# Altium schematic sheet Sheet2.SchDoc
size A4; SheetNumber: 2; SheetTotal: 2
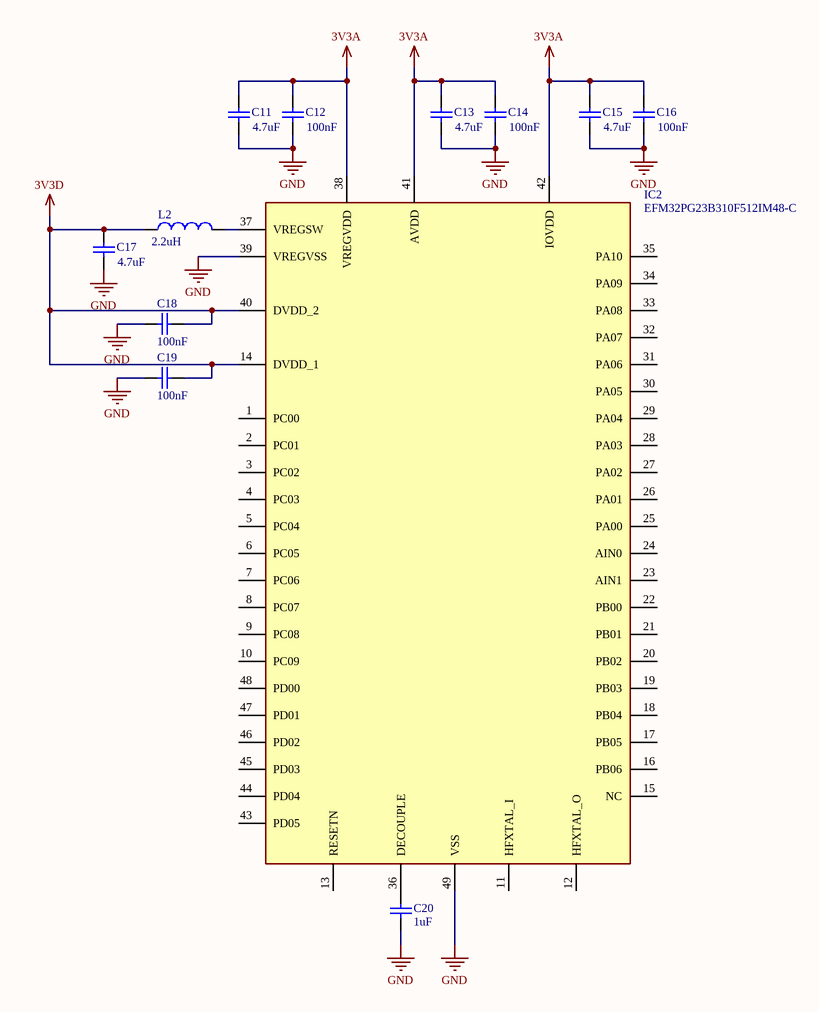
[diagram p0: Sheet2.SchDoc]

## Parts
C11  value 4.7uF  [CAPC1608X92X38LL15T08]  (hidden comment: VJ0603D3R9CXPAJ)
C12  value 100nF  [CAPC1608X92X38LL15T08]  (hidden comment: VJ0603D3R9CXPAJ)
C13  value 4.7uF  [CAPC1608X92X38LL15T08]  (hidden comment: VJ0603D3R9CXPAJ)
C14  value 100nF  [CAPC1608X92X38LL15T08]  (hidden comment: VJ0603D3R9CXPAJ)
C15  value 4.7uF  [CAPC1608X92X38LL15T08]  (hidden comment: VJ0603D3R9CXPAJ)
C16  value 100nF  [CAPC1608X92X38LL15T08]  (hidden comment: VJ0603D3R9CXPAJ)
C17  value 4.7uF  [CAPC1608X92X38LL15T08]  (hidden comment: VJ0603D3R9CXPAJ)
C18  value 100nF  [CAPC1608X92X38LL15T08]  (hidden comment: VJ0603D3R9CXPAJ)
C19  value 100nF  [CAPC1608X92X38LL15T08]  (hidden comment: VJ0603D3R9CXPAJ)
C20  value 1uF  [CAPC1608X92X38LL15T08]  (hidden comment: VJ0603D3R9CXPAJ)
IC2  EFM32PG23B310F512IM48-C  [QFN40P600X600X90-49N-D]
L2  Inductance: 2.2uH  [WE-MK_0603_L1.6W0.8H0.8]  (hidden comment: 7447860115G)

## Nets
3V3A: C11.2 C12.2 C13.2 C14.2 C15.2 C16.2 IC2.38(VREGVDD) IC2.41(AVDD) IC2.42(IOVDD)
3V3D: C17.2 C18.1 C19.1 IC2.14(DVDD_1) IC2.40(DVDD_2) L2.1
GND: C11.1 C12.1 C13.1 C14.1 C15.1 C16.1 C17.1 C18.2 C19.2 C20.2 IC2.39(VREGVSS) IC2.49(VSS)
NetC20_1: C20.1 IC2.36(DECOUPLE)
NetIC2_37: IC2.37(VREGSW) L2.2

Not connected (* = marked no-connect by the designer): IC2 1(PC00) 2(PC01) 3(PC02) 4(PC03) 5(PC04) 6(PC05) 7(PC06) 8(PC07) 9(PC08) 10(PC09) 11(HFXTAL_I) 12(HFXTAL_O) 13(RESETN) 15(NC) 16(PB06) 17(PB05) 18(PB04) 19(PB03) 20(PB02) 21(PB01) 22(PB00) 23(AIN1) 24(AIN0) 25(PA00) 26(PA01) 27(PA02) 28(PA03) 29(PA04) 30(PA05) 31(PA06) 32(PA07) 33(PA08) 34(PA09) 35(PA10) 43(PD05) 44(PD04) 45(PD03) 46(PD02) 47(PD01) 48(PD00)

## Library data of the parts
C11-C20 = CMP-2006-01519-1: Manufacturer: Vitramon; Part Number: VJ0603D3R9CXPAJ
IC2 = EFM32PG23B310F512IM48-C: Integrated Circuit; Manufacturer_Name: Silicon Labs; Datasheet Link: https://www.mouser.com/datasheet/2/368/efm32pg23_datasheet-2952668.pdf; Height: 0.9mm; Manufacturer_Part_Number: EFM32PG23B310F512IM48-C; Mouser Part Number: 634-PG23310F512IM48C; Mouser Price/Stock: https://www.mouser.co.uk/ProductDetail/Silicon-Labs/EFM32PG23B310F512IM48-C?qs=t7xnP681wgVHLxdeoMvbtg%3D%3D; Arrow Part Number: EFM32PG23B310F512IM48-C; Arrow Price/Stock: https://www.arrow.com/en/products/efm32pg23b310f512im48-c/silicon-labs?region=nac
L2 = CMP-03913-120013800-1: Current Rating: 550mA; Length: 1.6mm; NexarPartId: 120013800; Height: 800µm; RoHS: Compliant; Max Operating Temperature: 125°C; Ambient Temperature Range Low: -55°C; Width: 800µm; Ambient Temperature Range High: 105°C; Min Operating Temperature: -55°C